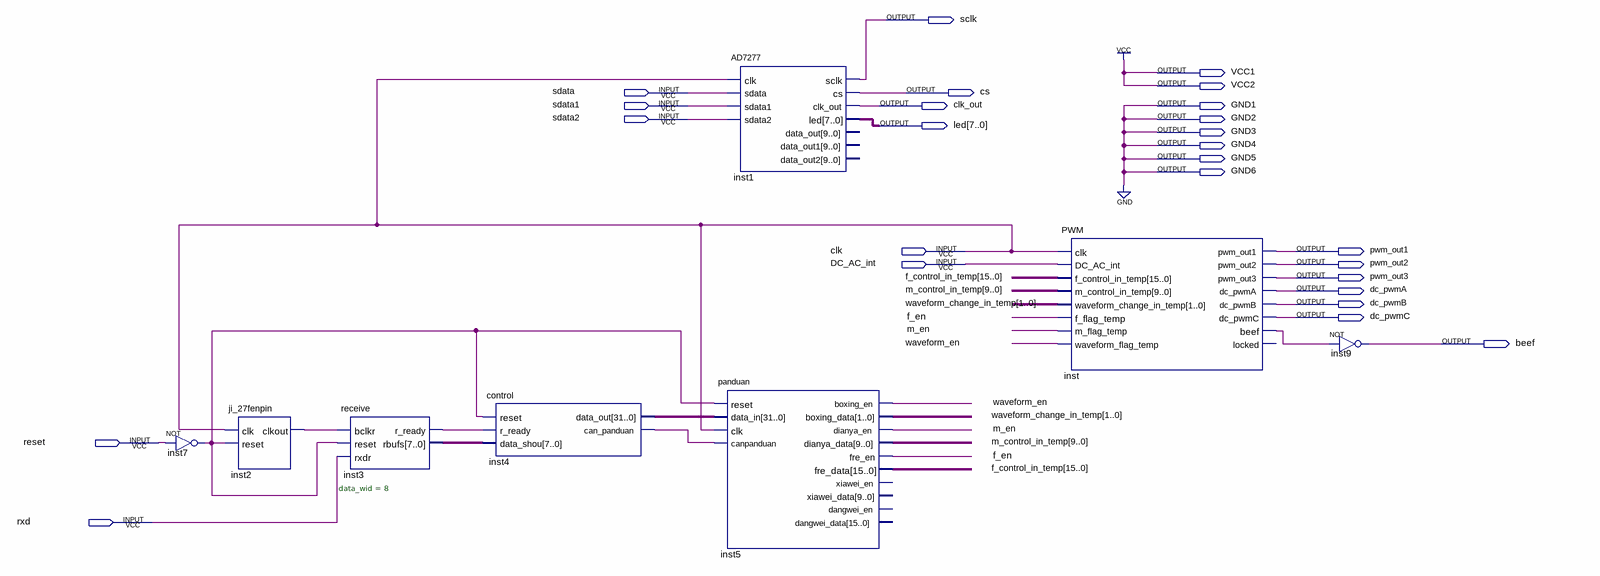
[diagram p0: schematic sheet]
// Quartus schematic test.bdf as structural Verilog: 8 symbols, 26 pins
module test (
  input  sdata,
  input  sdata1,
  input  sdata2,
  input  clk,
  input  DC_AC_int,
  input  reset,
  input  rxd,
  output sclk,
  output VCC1,
  output VCC2,
  output cs,
  output clk_out,
  output GND1,
  output GND2,
  output [7:0] led,
  output GND3,
  output GND4,
  output GND5,
  output GND6,
  output pwm_out1,
  output pwm_out2,
  output pwm_out3,
  output dc_pwmA,
  output dc_pwmB,
  output dc_pwmC,
  output beef
);

  wire f_en, inst2_clkout, inst3_r_ready, inst4_can_panduan, inst7_out, inst_beef, m_en, waveform_en;
  wire [1:0] waveform_change_in_temp;
  wire [7:0] inst3_rbufs;
  wire [9:0] m_control_in_temp;
  wire [15:0] f_control_in_temp;
  wire [31:0] inst4_data_out;

  not inst7 (inst7_out, reset);
  ji_27fenpin inst2 (.clk(clk), .reset(inst7_out), .clkout(inst2_clkout));
  receive #(.data_wid(8)) inst3 (
    .bclkr(inst2_clkout), .reset(inst7_out), .rxdr(rxd), .r_ready(inst3_r_ready), .rbufs(inst3_rbufs));
  control inst4 (
    .reset(inst7_out), .r_ready(inst3_r_ready), .data_shou(inst3_rbufs), .data_out(inst4_data_out),
    .can_panduan(inst4_can_panduan));
  AD7277 inst1 (
    .clk(clk), .sdata(sdata), .sdata1(sdata1), .sdata2(sdata2), .sclk(sclk), .cs(cs), .clk_out(clk_out),
    .led(led));  // open: data_out, data_out1, data_out2
  panduan inst5 (
    .reset(inst7_out), .data_in(inst4_data_out), .clk(clk), .canpanduan(inst4_can_panduan),
    .boxing_en(waveform_en), .boxing_data(waveform_change_in_temp), .dianya_en(m_en),
    .dianya_data(m_control_in_temp), .fre_en(f_en), .fre_data(f_control_in_temp));  // open: xiawei_en, xiawei_data, dangwei_en, dangwei_data
  PWM inst (
    .clk(clk), .DC_AC_int(DC_AC_int), .f_control_in_temp(f_control_in_temp),
    .m_control_in_temp(m_control_in_temp), .waveform_change_in_temp(waveform_change_in_temp),
    .f_flag_temp(f_en), .m_flag_temp(m_en), .waveform_flag_temp(waveform_en), .pwm_out1(pwm_out1),
    .pwm_out2(pwm_out2), .pwm_out3(pwm_out3), .dc_pwmA(dc_pwmA), .dc_pwmB(dc_pwmB), .dc_pwmC(dc_pwmC),
    .beef(inst_beef));  // open: locked
  not inst9 (beef, inst_beef);

  assign GND1 = 1'b0;
  assign GND2 = 1'b0;
  assign GND3 = 1'b0;
  assign GND4 = 1'b0;
  assign GND5 = 1'b0;
  assign GND6 = 1'b0;
  assign VCC1 = 1'b1;
  assign VCC2 = 1'b1;
endmodule
